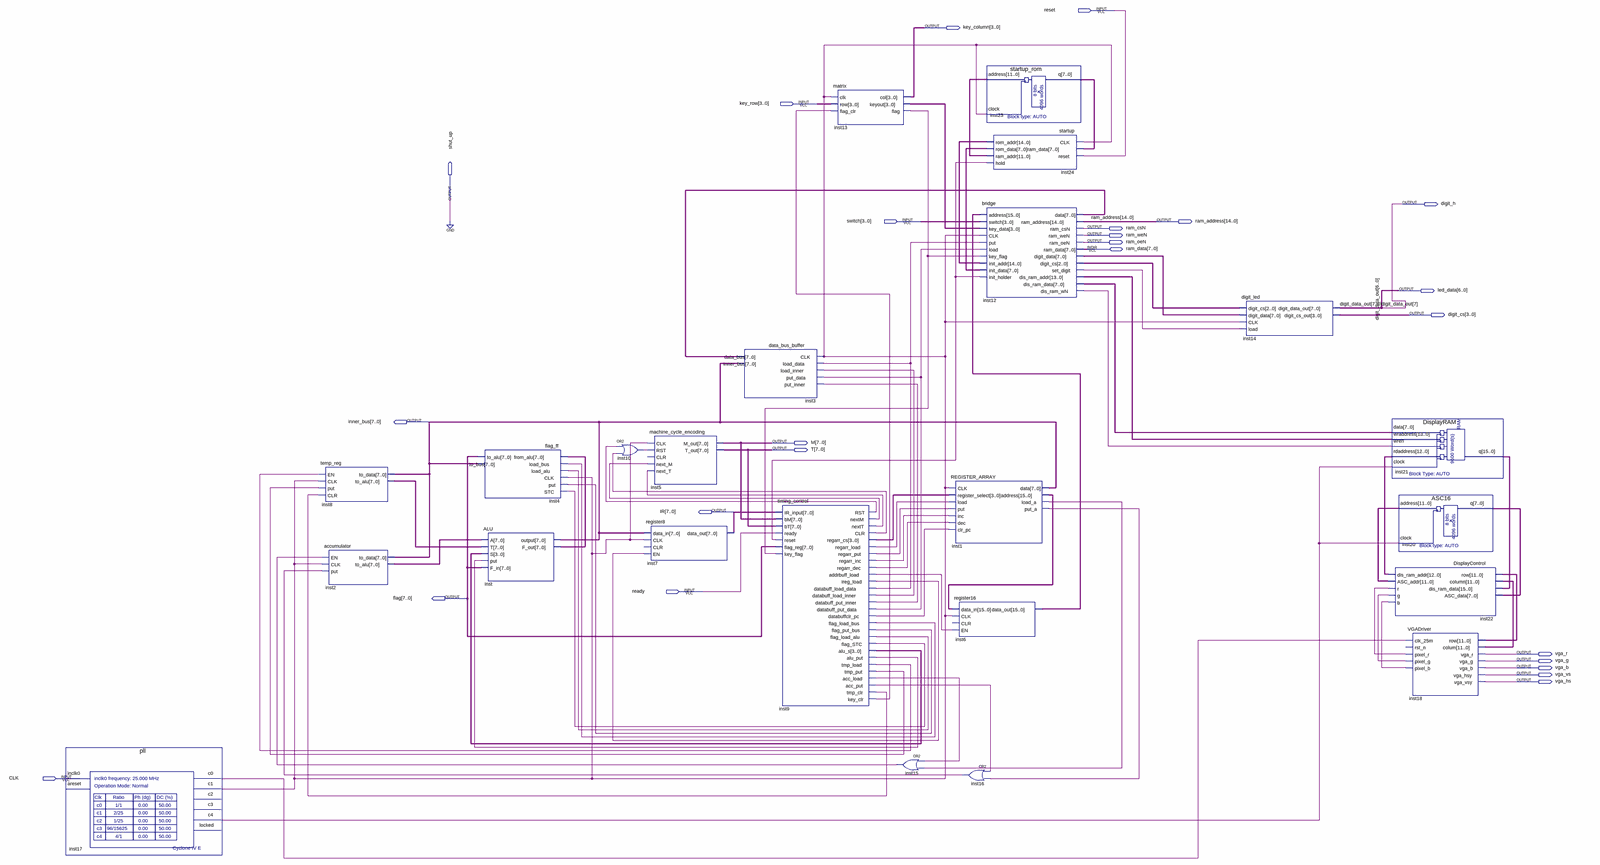
[diagram p0: schematic sheet, whole]
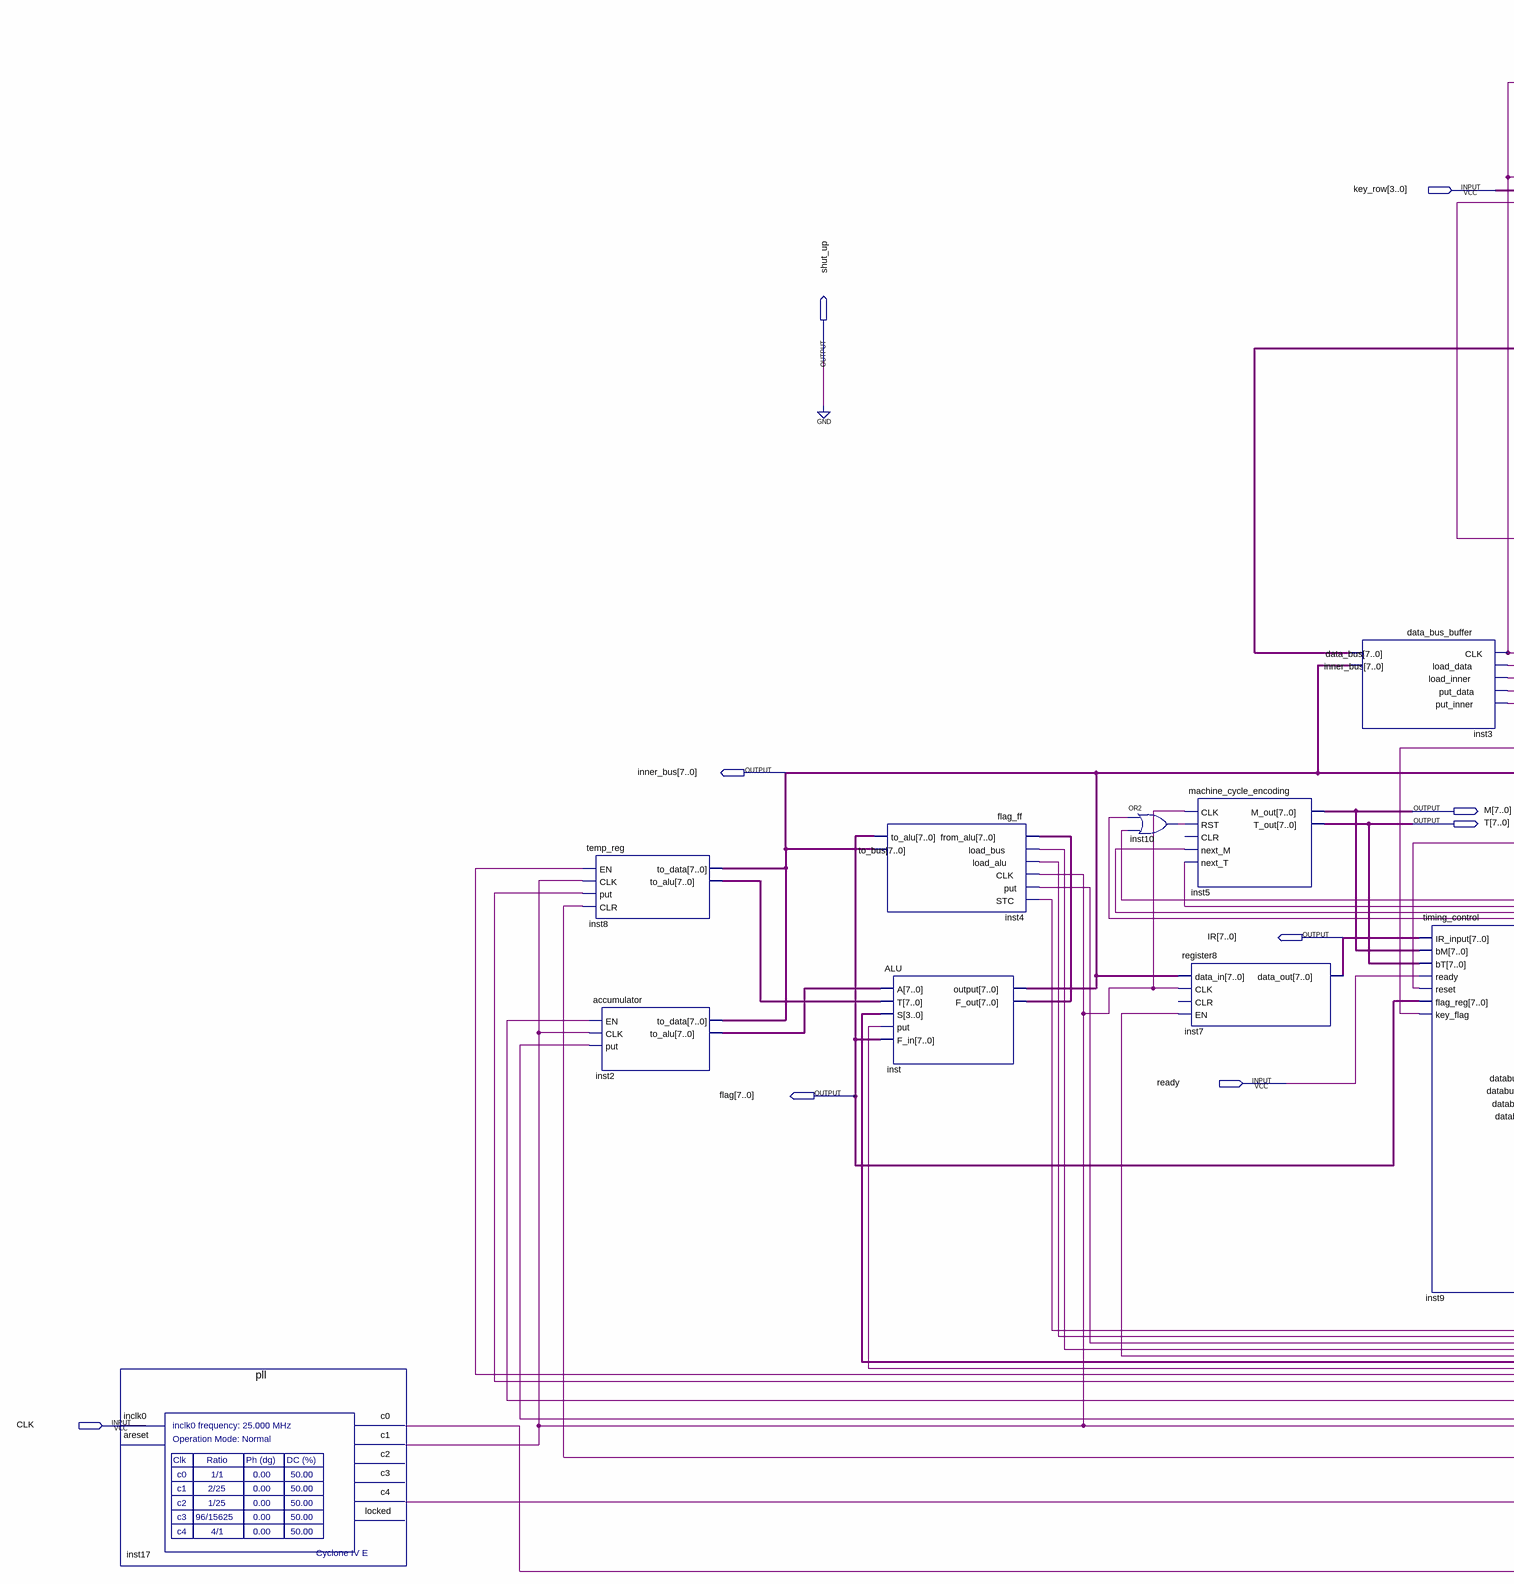
[diagram p1: schematic sheet, left part]
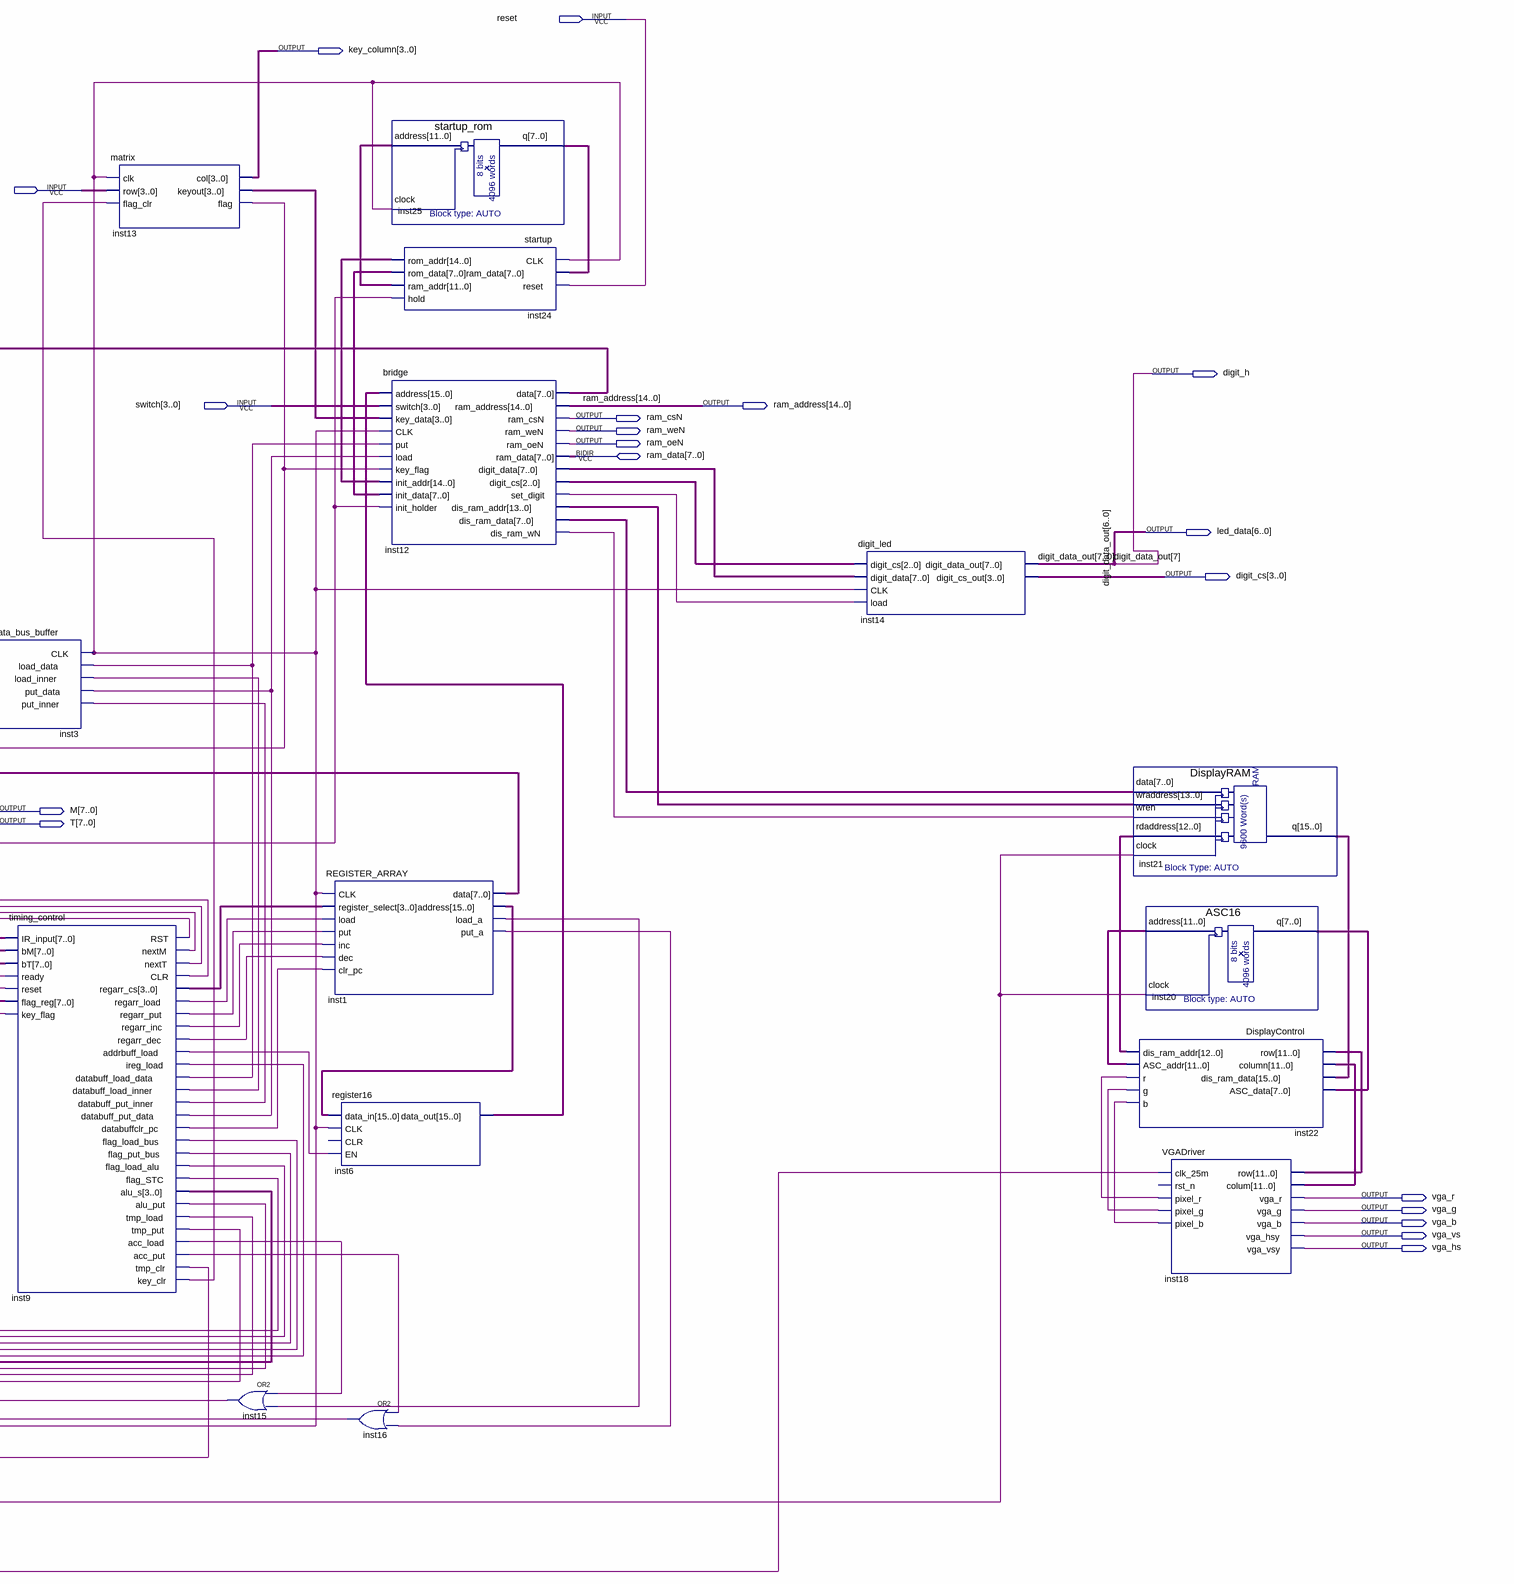
[diagram p2: schematic sheet, right part]
// Quartus schematic CPU.bdf as structural Verilog: 23 symbols, 25 pins
module CPU (
  input  reset,
  input  [3:0] key_row,
  input  [3:0] switch,
  input  ready,
  input  CLK,
  inout  [7:0] ram_data,
  output [3:0] key_column,
  output shut_up,
  output digit_h,
  output [14:0] ram_address,
  output ram_csN,
  output ram_weN,
  output ram_oeN,
  output [6:0] led_data,
  output [3:0] digit_cs,
  output [7:0] inner_bus,
  output [7:0] M,
  output [7:0] T,
  output [7:0] IR,
  output [7:0] flag,
  output vga_r,
  output vga_g,
  output vga_b,
  output vga_vs,
  output vga_hs
);

  wire inst1_load_a, inst1_put_a, inst9_acc_load, inst9_acc_put, inst9_addrbuff_load, inst9_alu_put,
       inst9_clr, inst9_databuff_load_data, inst9_databuff_load_inner, inst9_databuff_put_data,
       inst9_databuff_put_inner, inst9_databuffclr_pc, inst9_flag_load_alu, inst9_flag_load_bus,
       inst9_flag_put_bus, inst9_flag_stc, inst9_ireg_load, inst9_key_clr, inst9_nextm, inst9_nextt,
       inst9_regarr_dec, inst9_regarr_inc, inst9_regarr_load, inst9_regarr_put, inst9_rst, inst9_tmp_clr,
       inst9_tmp_load, inst9_tmp_put, inst10_out, inst12_dis_ram_wn, inst12_set_digit, inst13_flag,
       inst15_out, inst16_out, inst17_c0, inst17_c1, inst17_c4, inst22_b, inst22_g, inst22_r, inst24_hold;
  wire [2:0] inst12_digit_cs;
  wire [3:0] inst9_alu_s, inst9_regarr_cs, inst13_keyout;
  wire [7:0] inst2_to_alu, inst3_data_bus, inst8_to_alu, inst12_digit_data, inst12_dis_ram_data, inst20_q,
       inst24_rom_data, inst25_q, inst_f_out;
  wire [11:0] inst18_colum, inst18_row, inst22_asc_addr, inst24_ram_addr;
  wire [12:0] inst22_dis_ram_addr;
  wire [13:0] inst12_dis_ram_addr;
  wire [14:0] inst24_rom_addr;
  wire [15:0] inst1_address, inst6_data_out, inst21_q;

  pll inst17 (.inclk0(CLK), .c0(inst17_c0), .c1(inst17_c1), .c4(inst17_c4));  // open: areset, c2, c3, locked
  temp_reg inst8 (
    .EN(inst9_tmp_load), .CLK(inst17_c1), .put(inst9_tmp_put), .CLR(inst9_tmp_clr), .to_alu(inst8_to_alu),
    .to_data(inner_bus));
  accumulator inst2 (.EN(inst15_out), .CLK(inst17_c1), .put(inst16_out), .to_alu(inst2_to_alu), .to_data(inner_bus));
  flag_ff inst4 (
    .from_alu(inst_f_out), .load_bus(inst9_flag_load_bus), .load_alu(inst9_flag_load_alu), .CLK(inst17_c1),
    .put(inst9_flag_put_bus), .STC(inst9_flag_stc), .to_alu(flag), .to_bus(inner_bus));
  ALU inst (
    .A(inst2_to_alu), .T(inst8_to_alu), .S(inst9_alu_s), .put(inst9_alu_put), .F_in(flag),
    .\output (inner_bus), .F_out(inst_f_out));
  or inst10 (inst10_out, inst9_rst, inst9_clr);
  machine_cycle_encoding inst5 (
    .CLK(inst17_c1), .RST(inst10_out), .next_M(inst9_nextm), .next_T(inst9_nextt), .M_out(M), .T_out(T));  // open: CLR
  register8 inst7 (.data_in(inner_bus), .CLK(inst17_c1), .EN(inst9_ireg_load), .data_out(IR));  // open: CLR
  data_bus_buffer inst3 (
    .CLK(inst17_c1), .load_data(inst9_databuff_load_data), .load_inner(inst9_databuff_load_inner),
    .put_data(inst9_databuff_put_data), .put_inner(inst9_databuff_put_inner), .data_bus(inst3_data_bus),
    .inner_bus(inner_bus));
  timing_control inst9 (
    .IR_input(IR), .bM(M), .bT(T), .ready(ready), .reset(inst24_hold), .flag_reg(flag),
    .key_flag(inst13_flag), .RST(inst9_rst), .nextM(inst9_nextm), .nextT(inst9_nextt), .CLR(inst9_clr),
    .regarr_cs(inst9_regarr_cs), .regarr_load(inst9_regarr_load), .regarr_put(inst9_regarr_put),
    .regarr_inc(inst9_regarr_inc), .regarr_dec(inst9_regarr_dec), .addrbuff_load(inst9_addrbuff_load),
    .ireg_load(inst9_ireg_load), .databuff_load_data(inst9_databuff_load_data),
    .databuff_load_inner(inst9_databuff_load_inner), .databuff_put_inner(inst9_databuff_put_inner),
    .databuff_put_data(inst9_databuff_put_data), .databuffclr_pc(inst9_databuffclr_pc),
    .flag_load_bus(inst9_flag_load_bus), .flag_put_bus(inst9_flag_put_bus),
    .flag_load_alu(inst9_flag_load_alu), .flag_STC(inst9_flag_stc), .alu_s(inst9_alu_s),
    .alu_put(inst9_alu_put), .tmp_load(inst9_tmp_load), .tmp_put(inst9_tmp_put), .acc_load(inst9_acc_load),
    .acc_put(inst9_acc_put), .tmp_clr(inst9_tmp_clr), .key_clr(inst9_key_clr));
  matrix inst13 (
    .clk(inst17_c1), .row(key_row), .flag_clr(inst9_key_clr), .col(key_column), .keyout(inst13_keyout),
    .flag(inst13_flag));
  or inst15 (inst15_out, inst9_acc_load, inst1_load_a);
  REGISTER_ARRAY inst1 (
    .CLK(inst17_c1), .register_select(inst9_regarr_cs), .load(inst9_regarr_load), .put(inst9_regarr_put),
    .inc(inst9_regarr_inc), .dec(inst9_regarr_dec), .clr_pc(inst9_databuffclr_pc), .address(inst1_address),
    .load_a(inst1_load_a), .put_a(inst1_put_a), .data(inner_bus));
  register16 inst6 (
    .data_in(inst1_address), .CLK(inst17_c1), .EN(inst9_addrbuff_load), .data_out(inst6_data_out));  // open: CLR
  bridge inst12 (
    .address(inst6_data_out), .switch(switch), .key_data(inst13_keyout), .CLK(inst17_c1),
    .put(inst9_databuff_load_data), .load(inst9_databuff_put_data), .key_flag(inst13_flag),
    .init_addr(inst24_rom_addr), .init_data(inst24_rom_data), .init_holder(inst24_hold),
    .ram_address(ram_address), .ram_csN(ram_csN), .ram_weN(ram_weN), .ram_oeN(ram_oeN),
    .digit_data(inst12_digit_data), .digit_cs(inst12_digit_cs), .set_digit(inst12_set_digit),
    .dis_ram_addr(inst12_dis_ram_addr), .dis_ram_data(inst12_dis_ram_data), .dis_ram_wN(inst12_dis_ram_wn),
    .data(inst3_data_bus), .ram_data(ram_data));
  or inst16 (inst16_out, inst9_acc_put, inst1_put_a);
  startup_rom inst25 (.address(inst24_ram_addr), .clock(inst17_c1), .q(inst25_q));
  startup inst24 (
    .CLK(inst17_c1), .ram_data(inst25_q), .reset(reset), .rom_addr(inst24_rom_addr),
    .rom_data(inst24_rom_data), .ram_addr(inst24_ram_addr), .hold(inst24_hold));
  digit_led inst14 (
    .digit_cs(inst12_digit_cs), .digit_data(inst12_digit_data), .CLK(inst17_c1), .load(inst12_set_digit),
    .digit_data_out({digit_h, led_data}), .digit_cs_out(digit_cs));
  DisplayRAM inst21 (
    .data(inst12_dis_ram_data), .wraddress(inst12_dis_ram_addr), .wren(inst12_dis_ram_wn),
    .rdaddress(inst22_dis_ram_addr), .clock(inst17_c4), .q(inst21_q));
  DisplayControl inst22 (
    .row(inst18_row), .column(inst18_colum), .dis_ram_data(inst21_q), .ASC_data(inst20_q),
    .dis_ram_addr(inst22_dis_ram_addr), .ASC_addr(inst22_asc_addr), .r(inst22_r), .g(inst22_g), .b(inst22_b));
  ASC16 inst20 (.address(inst22_asc_addr), .clock(inst17_c4), .q(inst20_q));
  VGADriver inst18 (
    .clk_25m(inst17_c0), .pixel_r(inst22_r), .pixel_g(inst22_g), .pixel_b(inst22_b), .row(inst18_row),
    .colum(inst18_colum), .vga_r(vga_r), .vga_g(vga_g), .vga_b(vga_b), .vga_hsy(vga_vs), .vga_vsy(vga_hs));  // open: rst_n

  assign shut_up = 1'b0;

  // Other names for the same wires on the sheet: digit_data_out[7:0] = {digit_h, led_data}
endmodule
